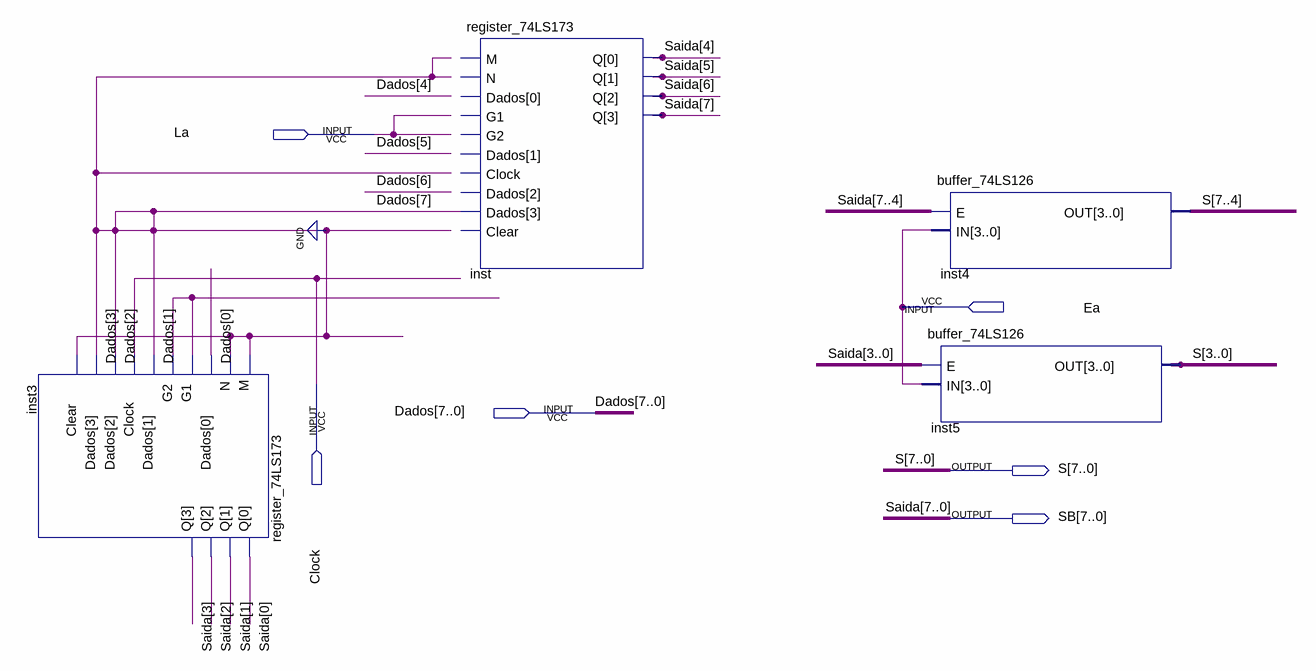
[diagram p0: schematic sheet]
// Quartus schematic a_acumula.bdf as structural Verilog: 4 symbols, 6 pins
module a_acumula (
  input  La,
  input  Ea,
  input  Clock,
  input  [7:0] Dados,
  output [7:0] S,
  output [7:0] SB
);

  wire undriven;

  register_74LS173 inst3 (
    .M(Dados[7]), .N(Dados[7]), .Dados({{3{Dados[7]}}, Dados[0]}), .G1(undriven), .G2(undriven),
    .Clock(Clock), .Clear(Dados[7]), .Q(SB[3:0]));
  register_74LS173 inst (.Dados({Dados[7], 3'bzzz}), .Q(SB[7:4]));  // open: M, N, G1, G2, Clock, Clear
  buffer_74LS126 inst4 (.E(SB[7:4]), .IN({4{Ea}}), .OUT(S[7:4]));
  buffer_74LS126 inst5 (.E(SB[3:0]), .IN({4{Ea}}), .OUT(S[3:0]));

  assign Dados[3:1] = {3{Dados[7]}};
  // also tied to GND on the sheet: Dados[7]

  // Other names for the same wires on the sheet: Saida[7:0] = SB
endmodule
